# EAGLE design PA_PF_220_24_V301 (EAGLE 5.04)
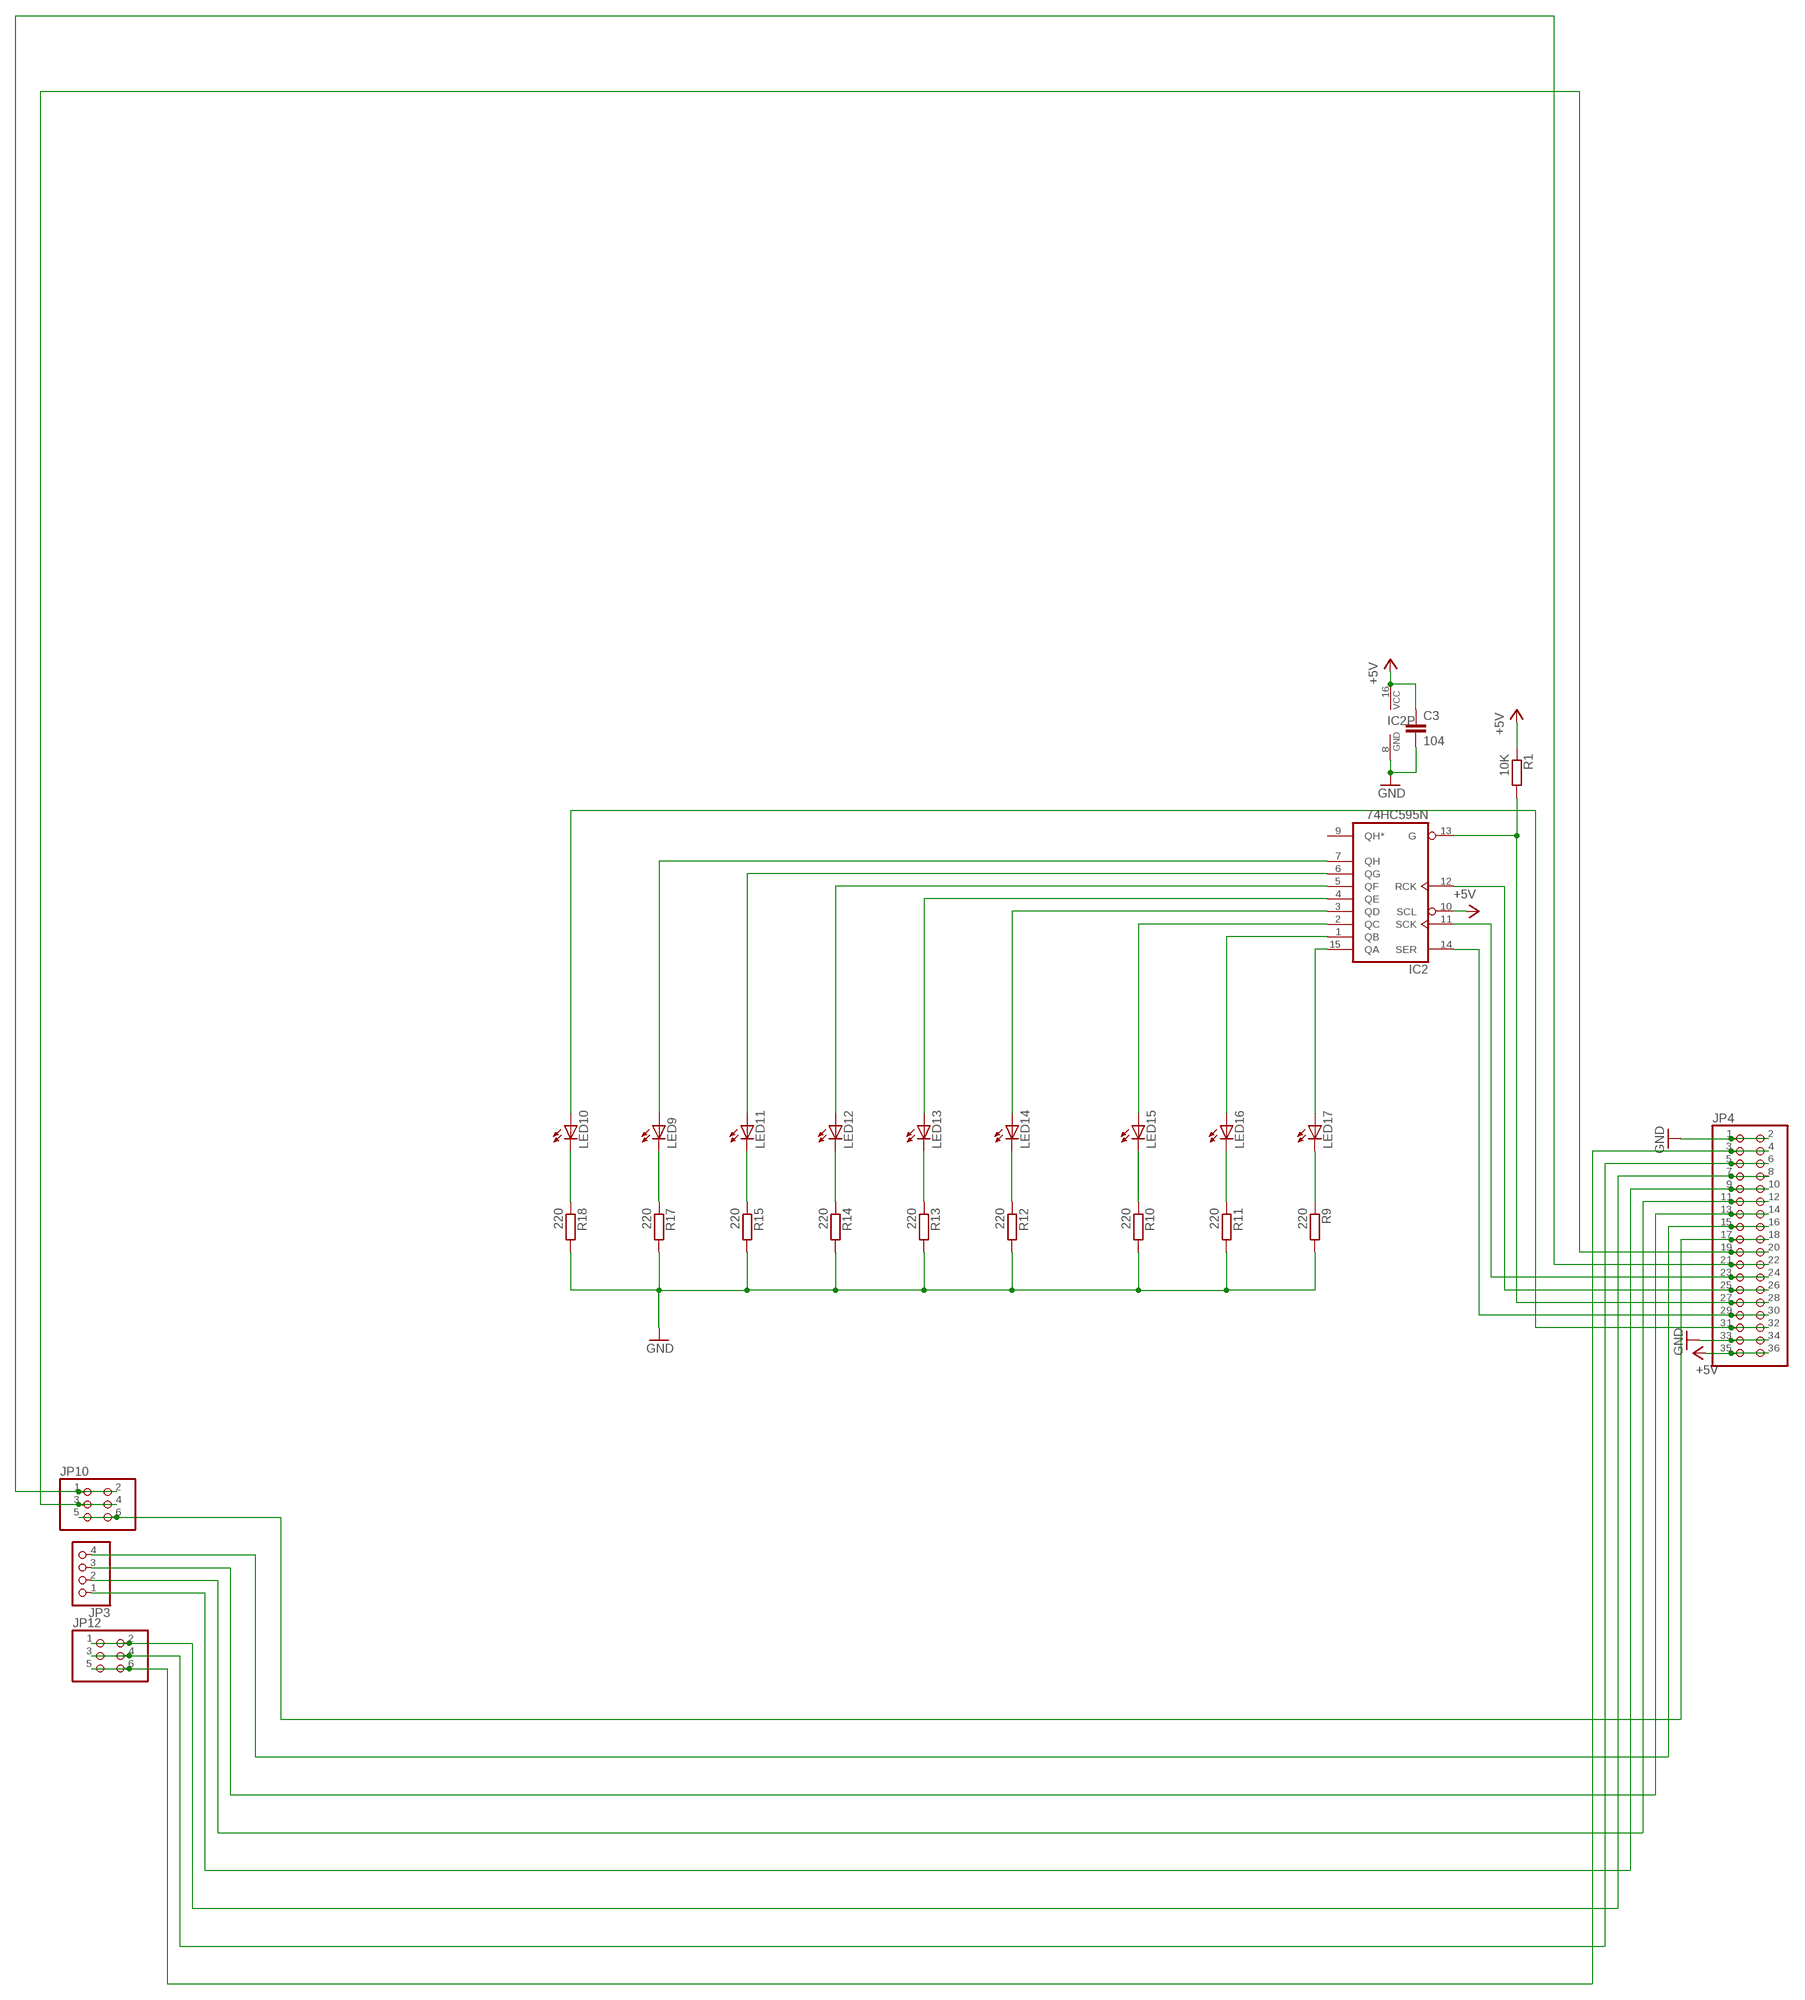
[diagram p0: schematic, sheet 1, part 1 of 3]
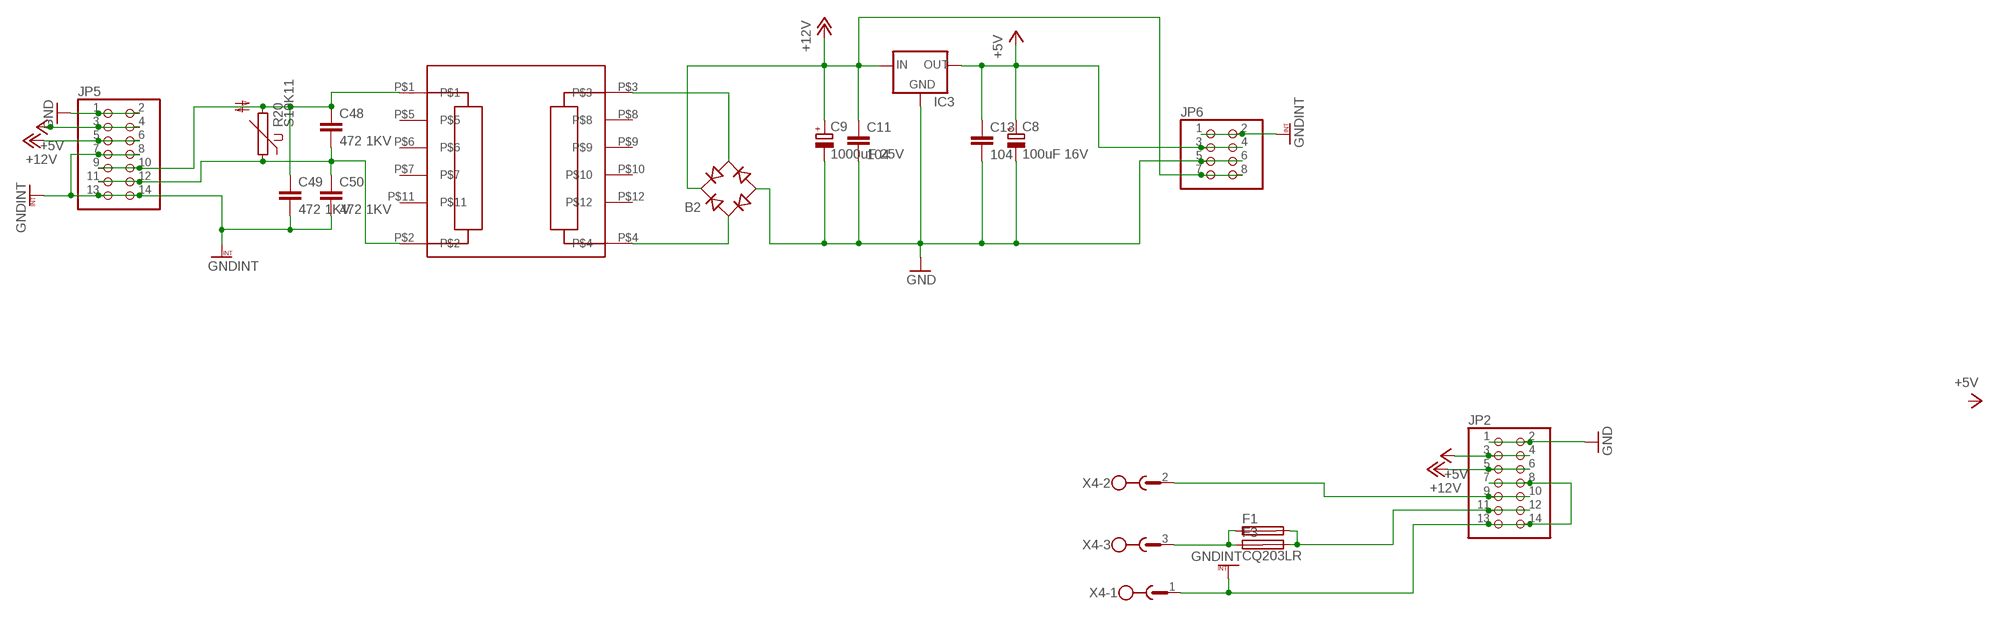
[diagram p1: schematic, sheet 1, part 2 of 3]
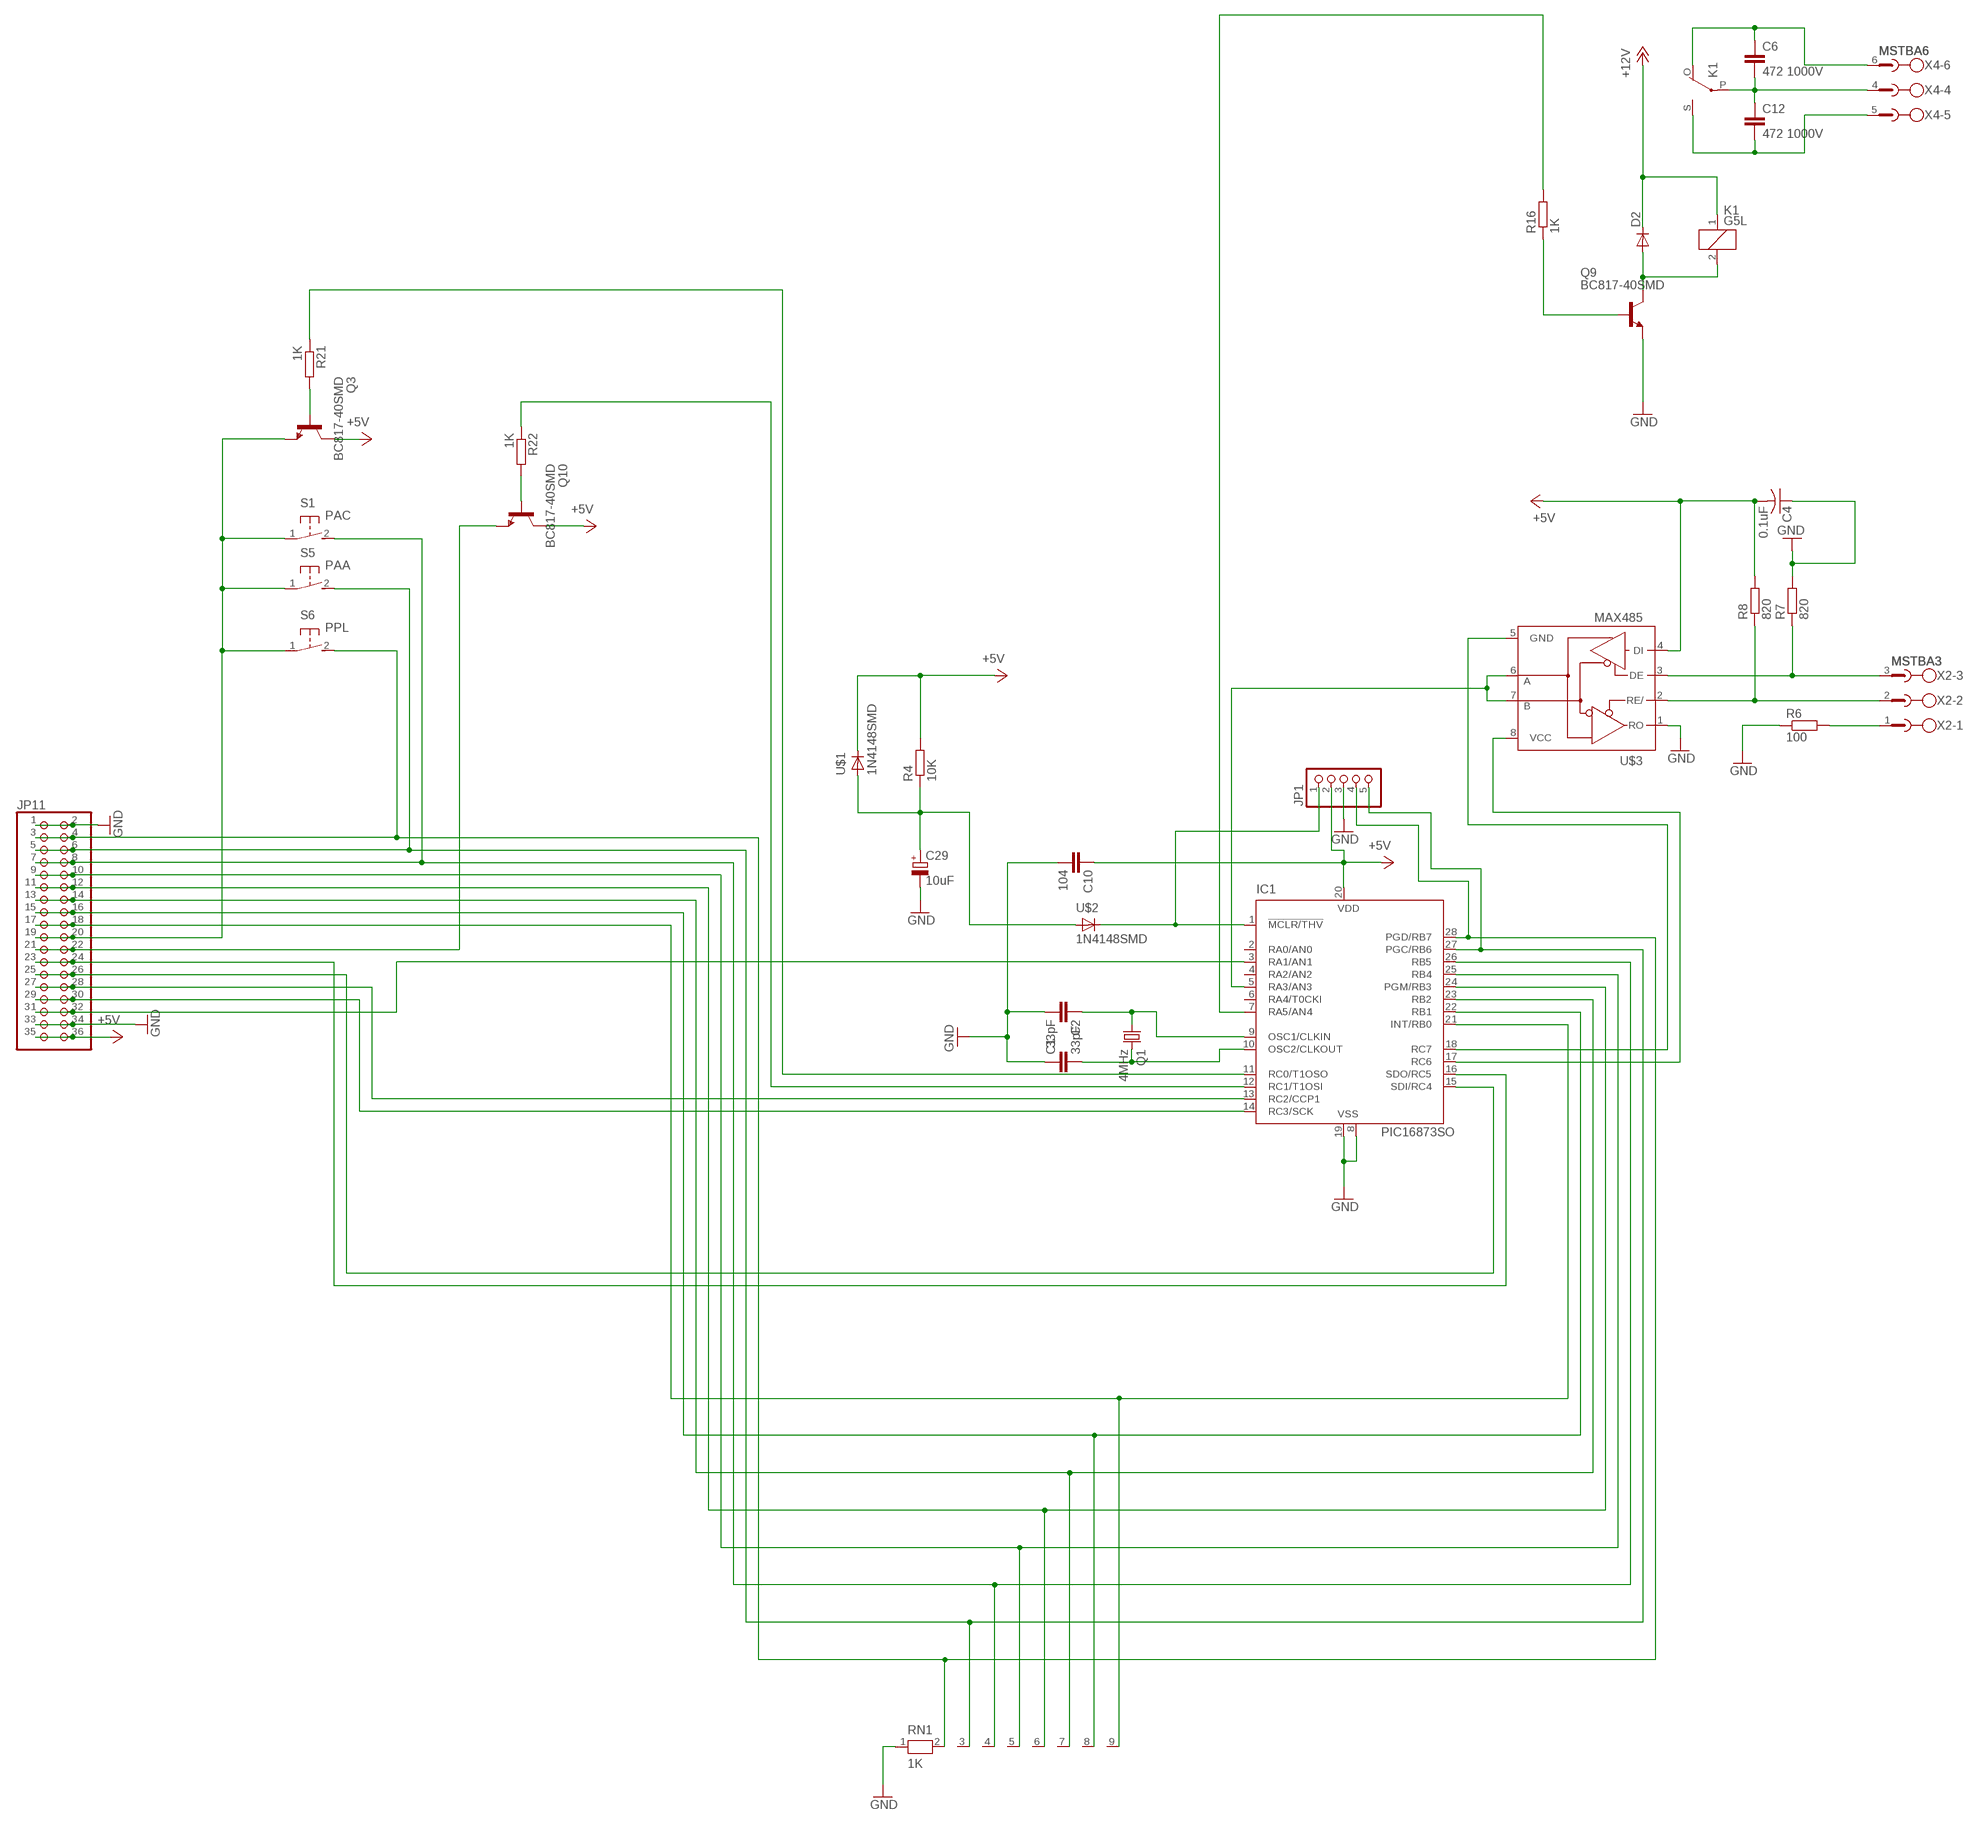
[diagram p2: schematic, sheet 1, part 3 of 3]

## Parts
B2  RB1A  [RB1A]
C1  33pF  C-EUC0805  [C0805]
C2  33pF  C-EUC0805  [C0805]
C3  104  C-EUC0805  [C0805]
C4  0.1uF  C-USC0805  [C0805]
C6  472 1000V  C-EU050-025X075  [C050-025X075]
C8  100uF 16V  CPOL-EUE2.5-6  [E2,5-6]
C9  1000uF 25V  CPOL-EUE5-10.5  [E5-10,5]
C10  104  C-EUC0805  [C0805]
C11  104  C-EUC0805  [C0805]
C12  472 1000V  C-EU050-025X075  [C050-025X075]
C13  104  C-EUC0805  [C0805]
C29  10uF  CPOL-EUE2.5-6  [E2,5-6]
C48  472 1KV  C-EU050-025X075  [C050-025X075]
C49  472 1KV  C-EU050-025X075  [C050-025X075]
C50  472 1KV  C-EU050-025X075  [C050-025X075]
D2  DIODE-DO-214AC  [DO-214AC]
F1  SH22  [SH22]
F3  CQ203LR  SHK20Q  [SHK20Q]
IC1  PIC16873SO  [SO28W]
IC2  74HC595N  [DIL16]
IC3  78XXS  [78XXS]
JP1  PINHD-1X5  [1X05]
JP2  PINHD-2X7  [2X07]
JP3  PINHD-1X4  [1X04]
JP4  PINHD-2X18  [2X18]
JP5  PINHD-2X7  [2X07]
JP6  PINHD-2X4  [2X04]
JP10  PINHD-2X3  [2X03]
JP11  PINHD-2X18  [2X18]
JP12  PINHD-2X3  [2X03]
K1  G5L  [G5LE]
LED9  LED10MM  [LED10MM]
LED10  LED5MM  [LED5MM]
LED11  LED10MM  [LED10MM]
LED12  LED10MM  [LED10MM]
LED13  LED10MM  [LED10MM]
LED14  LED10MM  [LED10MM]
LED15  LED10MM  [LED10MM]
LED16  LED10MM  [LED10MM]
LED17  LED10MM  [LED10MM]
Q1  4MHz  CRYTALHC49S  [HC49/S]
Q3  BC817-40SMD  [SOT23-BEC]
Q9  BC817-40SMD  [SOT23-BEC]
Q10  BC817-40SMD  [SOT23-BEC]
R1  10K  R-EU_M0805  [M0805]
R4  10K  R-EU_M0805  [M0805]
R6  100  R-EU_M0805  [M0805]
R7  820  R-EU_M0805  [M0805]
R8  820  R-EU_M0805  [M0805]
R9  220  R-EU_M0805  [M0805]
R10  220  R-EU_M0805  [M0805]
R11  220  R-EU_M0805  [M0805]
R12  220  R-EU_M0805  [M0805]
R13  220  R-EU_M0805  [M0805]
R14  220  R-EU_M0805  [M0805]
R15  220  R-EU_M0805  [M0805]
R16  1K  R-EU_M0805  [M0805]
R17  220  R-EU_M0805  [M0805]
R18  220  R-EU_M0805  [M0805]
R20  S10K11  [S10K11]
R21  1K  R-EU_M0805  [M0805]
R22  1K  R-EU_M0805  [M0805]
RN1  1K  RN08  [RN-9]
S1  PAC  31-XX  [B3F-31XX]
S5  PAA  31-XX  [B3F-31XX]
S6  PPL  31-XX  [B3F-31XX]
U$1  1N4148SMD  [SOD123]
U$2  1N4148SMD  [SOD123]
U$3  MAX485  [DIL08]
U$4  EI25_12/0  [EI25_12/0-PLACA]
X2  MSTBA3  [MSTBA3]
X4  MSTBA6  [MSTBA6]

## Nets
+5V: C3.1 C4.2 C8.+ C10.1 C13.1 IC1.20(VDD) IC2.10(SCL) IC2.16(VCC) IC3.OUT JP1.2 JP2.3 JP2.4 JP4.35 JP4.36 JP5.3 JP5.4 JP6.3 JP6.4 JP11.35 JP11.36 Q3.C Q10.C R1.1 R4.2 R8.2 U$1.C U$3.4(DI)
+12V: B2.+ C9.+ C11.1 D2.C IC3.IN JP2.5 JP2.6 JP5.5 JP5.6 JP6.7 JP6.8 K1.1
GND: B2.- C1.1 C2.2 C3.2 C4.1 C8.- C9.- C10.2 C11.2 C13.2 C29.- IC1.8(VSS) IC1.19(VSS) IC2.8(GND) IC3.GND JP1.3 JP2.1 JP2.2 JP4.1 JP4.2 JP4.33 JP4.34 JP5.1 JP5.2 JP6.5 JP6.6 JP11.1 JP11.2 JP11.33 JP11.34 Q9.E R6.1 R7.2 R9.2 R10.2 R11.2 R12.2 R13.2 R14.2 R15.2 R17.2 R18.2 RN1.1 U$3.1(RO)
GNDINT: C49.2 C50.2 JP2.7 JP2.8 JP2.13 JP2.14 JP5.7 JP5.8 JP5.13 JP5.14 JP6.1 JP6.2 X4.1
N$1: IC1.15(SDI/RC4) JP11.25 JP11.26
N$2: IC1.13(RC2/CCP1) JP11.27 JP11.28
N$3: IC1.24(PGM/RB3) JP11.11 JP11.12 RN1.6
N$4: IC1.14(RC3/SCK) JP11.29 JP11.30
N$6: JP4.5 JP4.6 JP12.3 JP12.4
N$7: C48.2 C50.1 JP5.11 JP5.12 R20.1 U$4.P$2
N$8: IC1.12(RC1/T1OSI) R22.1
N$9: IC1.11(RC0/T1OSO) R21.1
N$10: F1.2 F3.2A JP2.11 JP2.12
N$13: JP2.9 JP2.10 X4.2
N$14: C48.1 C49.1 JP5.9 JP5.10 R20.2 U$4.P$1
N$15: B2.AC2 U$4.P$3
N$16: JP4.3 JP4.4 JP12.5 JP12.6
N$22: IC2.7(QH) LED9.A
N$23: IC2.6(QG) LED11.A
N$24: IC2.3(QD) LED14.A
N$28: Q3.B R21.2
N$31: B2.AC1 U$4.P$4
N$32: IC1.18(RC7) U$3.5(GND)
N$33: F1.1 F3.1A X4.3
N$34: IC1.17(RC6) U$3.8(VCC)
N$35: IC1.5(RA3/AN3) U$3.6(A) U$3.7(B)
N$36: Q10.B R22.2
N$38: JP4.7 JP4.8 JP12.1 JP12.2
N$44: IC2.15(QA) LED17.A
N$45: IC2.5(QF) LED12.A
N$46: IC2.4(QE) LED13.A
N$47: IC2.2(QC) LED15.A
N$48: JP3.1 JP4.9 JP4.10
N$49: IC1.3(RA1/AN1) JP11.31 JP11.32
N$50: JP3.2 JP4.11 JP4.12
N$51: JP4.21 JP4.22 JP10.1 JP10.2
N$52: IC2.1(QB) LED16.A
N$53: R7.1 U$3.3(DE) X2.3
N$54: R8.1 U$3.2(RE/) X2.2
N$55: C6.2 C12.1 K1.P(2:P) X4.4
N$59: IC1.28(PGD/RB7) JP1.4 JP11.3 JP11.4 RN1.2 S6.2(S)
N$60: IC1.27(PGC/RB6) JP1.5 JP11.5 JP11.6 RN1.3 S5.2(S)
N$61: IC1.26(RB5) JP11.7 JP11.8 RN1.4 S1.2(S)
N$62: JP3.3 JP4.13 JP4.14
N$64: JP3.4 JP4.15 JP4.16
N$65: IC2.11(SCK) JP4.23 JP4.24
N$66: JP4.17 JP4.18 JP10.5 JP10.6
N$67: JP4.19 JP4.20 JP10.3 JP10.4
N$68: JP11.21 JP11.22 Q10.E
N$75: IC1.25(RB4) JP11.9 JP11.10 RN1.5
N$77: C2.1 IC1.9(OSC1/CLKIN) Q1.1
N$78: C1.2 IC1.10(OSC2/CLKOUT) Q1.2
N$79: IC1.1(!MCLR/THV) JP1.1 U$2.C
N$80: C29.+ R4.1 U$1.A U$2.A
N$83: IC1.23(RB2) JP11.13 JP11.14 RN1.7
N$84: IC1.16(SDO/RC5) JP11.23 JP11.24
N$85: IC2.12(RCK) JP4.25 JP4.26
N$86: R6.2 X2.1
N$87: IC1.22(RB1) JP11.15 JP11.16 RN1.8
N$88: IC2.13(G) JP4.27 JP4.28 R1.2
N$89: IC1.21(INT/RB0) JP11.17 JP11.18 RN1.9
N$90: IC2.14(SER) JP4.29 JP4.30
N$91: Q9.B R16.1
N$92: IC1.7(RA5/AN4) R16.2
N$93: D2.A K1.2 Q9.C
N$94: JP11.19 JP11.20 Q3.E S1.1(P) S5.1(P) S6.1(P)
N$95: JP4.31 JP4.32 LED10.A
N$100: LED17.K(C) R9.1
N$101: LED16.K(C) R11.1
N$103: LED15.K(C) R10.1
N$104: LED14.K(C) R12.1
N$105: LED13.K(C) R13.1
N$106: LED12.K(C) R14.1
N$107: LED11.K(C) R15.1
N$108: LED9.K(C) R17.1
N$109: LED10.K(C) R18.1
N$212: C6.1 K1.O(2:O) X4.6
N$214: C12.2 K1.S(2:S) X4.5
Unconnected: F3.1B F3.2B IC1.2(RA0/AN0) IC1.4(RA2/AN2) IC1.6(RA4/T0CKI) IC2.9(QH*) U$4.P$5 U$4.P$6 U$4.P$7 U$4.P$8 U$4.P$9 U$4.P$10 U$4.P$11 U$4.P$12

## Library data of the parts
B2 = rectifier:RB1A: RECTIFIER 1 A
C1-C3 C6 C10-C13 C48-C50 = rcl:C-EU: CAPACITOR, European symbol
C4 = rcl:C-US: CAPACITOR, American symbol
C8 C9 C29 = rcl:CPOL-EU: POLARIZED CAPACITOR, European symbol
D2 = diode:DIODE-: DIODE
F1 = fuse:SH22: FUSE HOLDER CS PFP30, Schukat
F3 = fuse:SHK20Q: FUSE HOLDER 5 x 20 mm, SH contact, E1207 Buerklin 64G6061
IC1 = microchip:PIC16*873: MICROCONTROLLER flash type
IC2 = 74xx-eu:74*595: 8-bit SHIFT REGISTER, output latch
IC3 = v-reg:78XXS: VOLTAGE REGULATOR
JP1 = pinhead:PINHD-1X5: PIN HEADER
JP2 JP5 = pinhead:PINHD-2X7: PIN HEADER
JP3 = pinhead:PINHD-1X4: PIN HEADER
JP4 JP11 = pinhead:PINHD-2X18: PIN HEADER
JP6 = pinhead:PINHD-2X4: PIN HEADER
JP10 JP12 = pinhead:PINHD-2X3: PIN HEADER
K1 = relay:G5L: RELAY 1 x switch, 10 A/120 V AC, 8 A/30 V ADC, Omron
LED9-LED17 = led:LED: LED OSRAM: - CHIPLED LG R971, LG N971, LY N971, LG Q971, LY Q971, LO R971, LY R971 LH N974, LH R974 LS Q976, LO Q976, LY Q976 LO Q996 - Hyper CHIPLED LW Q18S LB Q993, LB Q99A, LB R99A - SideLED LS A670, LO A670, LY A670, LG A670, LP A670 LB A673, LV A673, LT A673, LW A673 LH A674 LY A675 LS A676, LA A676, LO A676, LY A676, LW A676 LS A679, LY A679, LG A679 - Hyper Micro SIDELED® LS Y876, LA Y876, LO Y876, LY Y876 LT Y87S - SmartLED LW L88C, LW L88S LB L89C, LB L89S, LG L890 LS L89K, LO L89K, LY L89K LS L896, LA L896, LO L896, LY L896 - TOPLED LS T670, LO T670, LY T670, LG T670, LP T670 LSG T670, LSP T670, LSY T670, LOP T670, LYG T670 LG T671, LOG T671, LSG T671 LB T673, LV T673, LT T673, LW T673 LH T674 LS T676, LA T676, LO T676, LY T676, LB T676, LH T676, LSB T676, LW T676 LB T67C, LV T67C, LT T67C, LS T67K, LO T67K, LY T67K, LW E67C LS E67B, LA E67B, LO E67B, LY E67B, LB E67C, LV E67C, LT E67C LW T67C LS T679, LY T679, LG T679 LS T770, LO T770, LY T770, LG T770, LP T770 LB T773, LV T773, LT T773, LW T773 LH T774 LS E675, LA E675, LY E675, LS T675 LS T776, LA T776, LO T776, LY T776, LB T776 LHGB T686 LT T68C, LB T68C - Hyper Mini TOPLED® LB M676 - Mini TOPLED Santana® LG M470 LS M47K, LO M47K, LY M47K Source: http://www.osram.convergy.de LUXEON: - LUMILED® LXK2-PW12-R00, LXK2-PW12-S00, LXK2-PW14-U00, LXK2-PW14-V00 LXK2-PM12-R00, LXK2-PM12-S00, LXK2-PM14-U00 LXK2-PE12-Q00, LXK2-PE12-R00, LXK2-PE12-S00, LXK2-PE14-T00, LXK2-PE14-U00 LXK2-PB12-K00, LXK2-PB12-L00, LXK2-PB12-M00, LXK2-PB14-N00, LXK2-PB14-P00, LXK2-PB14-Q00 LXK2-PR12-L00, LXK2-PR12-M00, LXK2-PR14-Q00, LXK2-PR14-R00 LXK2-PD12-Q00, LXK2-PD12-R00, LXK2-PD12-S00 LXK2-PH12-R00, LXK2-PH12-S00 LXK2-PL12-P00, LXK2-PL12-Q00, LXK2-PL12-R00 Source: www.luxeon.com KINGBRIGHT: KA-3528ASYC Source: www.kingbright.com
Q1 = crystal:CRYTAL: CRYSTAL
Q3 Q9 Q10 = transistor-npn:BC817*: NPN Transistor
R1 R4 R6-R18 R21 R22 = rcl:R-EU_: RESISTOR, European symbol
R20 = varistor:S10K11: VARISTOR
RN1 = resistor-net:RN08: RESISTOR NETWORK
S1 S5 S6 = switch-omron:31-XX: OMRON SWITCH
U$1 U$2 = diode:1N4148SMD
U$3 = maxim:MAX485
U$4 = trafo:EI25_12/0
X2 = con-phoenix-508:MSTBA3: PHOENIX
X4 = con-phoenix-508:MSTBA6: PHOENIX

## Board
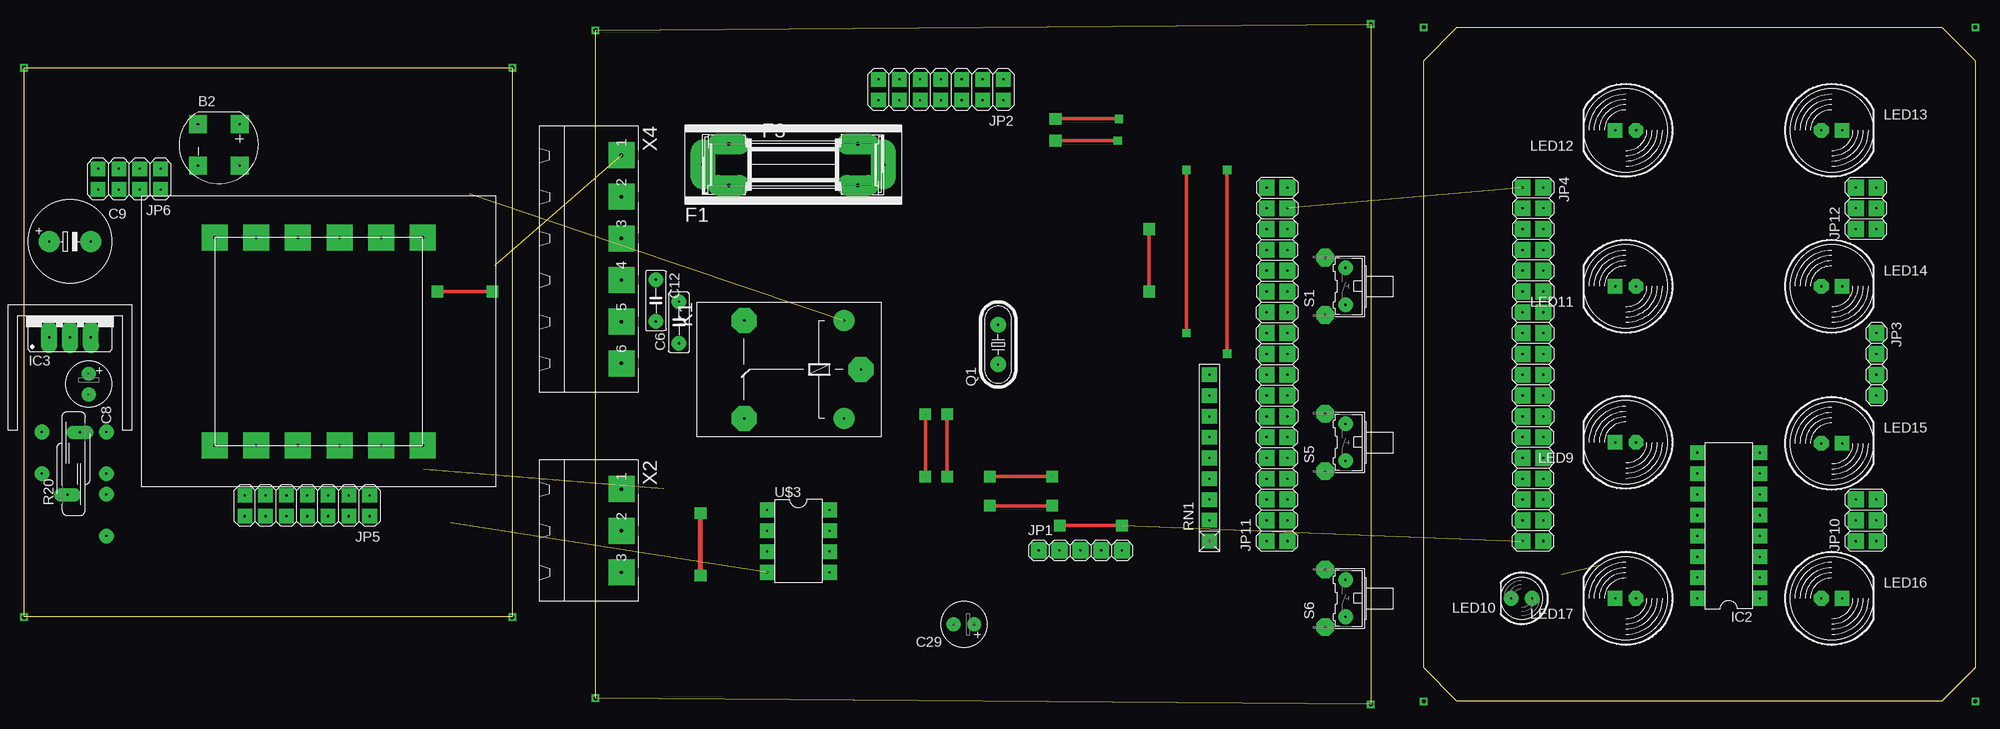
[diagram p3: board, top side]
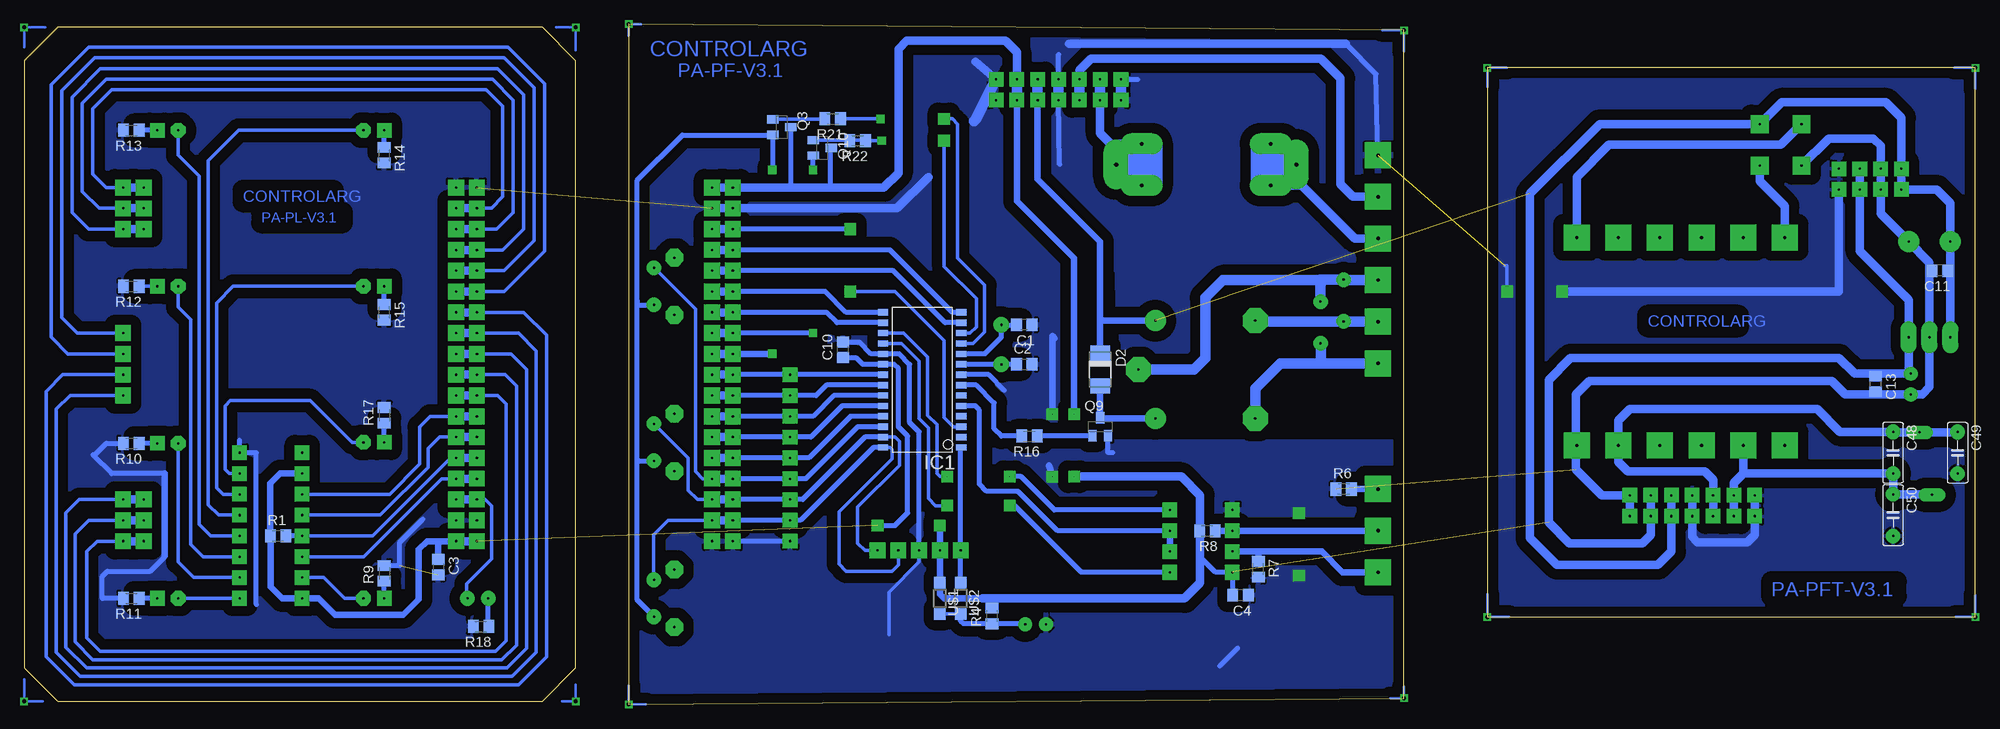
[diagram p4: board, bottom side, seen from below]

Size 238.12 x 83.06 mm. Coordinates in mm from the lower left corner, seen from the top.
Outline: 170.81,78.61 174.88,82.68 234.06,82.68 238.12,78.61 238.12,4.45 234.06,0.38 174.88,0.38 170.81,4.45 170.81,78.61
Outline: 69.72,82.3 164.34,83.06 164.34,0 69.72,0.76 69.72,82.3
Outline: 0,10.67 0,77.72 59.56,77.72 59.56,10.67 0,10.67
Copper layers (1*16): Top 0.035mm / dielectric 1.5mm / Bottom 0.035mm
Design rules "default": minimum track width 10mil, minimum drill 24mil, track to track 8mil, track to pad 8mil, pad to pad 8mil, via to via 8mil, smd to smd 8mil, copper to edge 40mil, drill to drill 8mil, minimum pad ring 10mil, minimum via ring 8mil, stop-mask expansion 4mil, vias tented up to drill 0mil, thermal gap 10mil

### Footprints (pad centres in the part's own frame; a part is rotated, then mirrored left to right if it is on the bottom)
RB1A = drill 0.254 pad 2.184 square: + -2.54,2.54; - 2.54,-2.54; AC1 2.54,2.54; AC2 -2.54,-2.54
C0805 = smd 1.3 x 1.5: 1 -0.95,0; 2 0.95,0
C050-025X075 = drill 0.254 pad 1.778 round: 1 -2.54,0; 2 2.54,0
E2,5-6 = drill 0.254 pad 1.676 round: + -1.27,0; - 1.27,0
E5-10,5 = drill 0.254 pad 2.54 round: + -2.54,0; - 2.54,0
DO-214AC = smd 1.8 x 2.4: A 2.025,0; C -2.025,0
SH22 = drill 0.5 pad 3.048 long: 1 -10.998,0; 2 10.998,0
SHK20Q = drill 0.406 pad 2.54 long: 1A -7.874,2.54; 1B -7.874,-2.54; 2A 7.874,2.54; 2B 7.874,-2.54
SO28W = smd 0.762 x 1.27: 1 -7.62,-4.78; 2 -6.35,-4.78; 3 -5.08,-4.78; 4 -3.81,-4.78; 5 -2.54,-4.78; 6 -1.27,-4.78; 7 0,-4.78; 8 1.27,-4.78; 9 2.54,-4.78; 10 3.81,-4.78; 11 5.08,-4.78; 12 6.35,-4.78; 13 7.62,-4.78; 14 8.89,-4.78; 15 8.89,4.78; 16 7.62,4.78; 17 6.35,4.78; 18 5.08,4.78; 19 3.81,4.78; 20 2.54,4.78; 21 1.27,4.78; 22 0,4.78; 23 -1.27,4.78; 24 -2.54,4.78; 25 -3.81,4.78; 26 -5.08,4.78; 27 -6.35,4.78; 28 -7.62,4.78
DIL16 = drill 0.254 pad 1.778 square: 1 -8.89,-3.81; 2 -6.35,-3.81; 3 -3.81,-3.81; 4 -1.27,-3.81; 5 1.27,-3.81; 6 3.81,-3.81; 7 6.35,-3.81; 8 8.89,-3.81; 9 8.89,3.81; 10 6.35,3.81; 11 3.81,3.81; 12 1.27,3.81; 13 -1.27,3.81; 14 -3.81,3.81; 15 -6.35,3.81; 16 -8.89,3.81
78XXS = drill 0.254 pad 1.93 long: GND 0,-2.54; IN -2.54,-2.54; OUT 2.54,-2.54
1X05 = drill 0.254 pad 1.93 square: 1 -5.08,0; 2 -2.54,0; 3 0,0; 4 2.54,0; 5 5.08,0
2X07 = drill 0.254 pad 1.778 square: 1 -7.62,-1.27; 2 -7.62,1.27; 3 -5.08,-1.27; 4 -5.08,1.27; 5 -2.54,-1.27; 6 -2.54,1.27; 7 0,-1.27; 8 0,1.27; 9 2.54,-1.27; 10 2.54,1.27; 11 5.08,-1.27; 12 5.08,1.27; 13 7.62,-1.27; 14 7.62,1.27
1X04 = drill 0.254 pad 1.93 square: 1 -3.81,0; 2 -1.27,0; 3 1.27,0; 4 3.81,0
2X18 = drill 0.254 pad 1.93 square: 1 -21.59,-1.27; 2 -21.59,1.27; 3 -19.05,-1.27; 4 -19.05,1.27; 5 -16.51,-1.27; 6 -16.51,1.27; 7 -13.97,-1.27; 8 -13.97,1.27; 9 -11.43,-1.27; 10 -11.43,1.27; 11 -8.89,-1.27; 12 -8.89,1.27; 13 -6.35,-1.27; 14 -6.35,1.27; 15 -3.81,-1.27; 16 -3.81,1.27; 17 -1.27,-1.27; 18 -1.27,1.27; 19 1.27,-1.27; 20 1.27,1.27; 21 3.81,-1.27; 22 3.81,1.27; 23 6.35,-1.27; 24 6.35,1.27; 25 8.89,-1.27; 26 8.89,1.27; 27 11.43,-1.27; 28 11.43,1.27; 29 13.97,-1.27; 30 13.97,1.27; 31 16.51,-1.27; 32 16.51,1.27; 33 19.05,-1.27; 34 19.05,1.27; 35 21.59,-1.27; 36 21.59,1.27
2X04 = drill 0.254 pad 1.778 square: 1 -3.81,-1.27; 2 -3.81,1.27; 3 -1.27,-1.27; 4 -1.27,1.27; 5 1.27,-1.27; 6 1.27,1.27; 7 3.81,-1.27; 8 3.81,1.27
2X03 = drill 0.254 pad 1.93 square: 1 -2.54,-1.27; 2 -2.54,1.27; 3 0,-1.27; 4 0,1.27; 5 2.54,-1.27; 6 2.54,1.27
G5LE = drill 0.254 pad 2.54 round: 1 -7.493,-5.969; 2 -7.493,5.969 | drill 0.254 pad 3.048 octagon: O 4.699,5.969; P -9.525,0; S 4.699,-5.969
LED10MM = drill 0.254 pad 1.778 octagon: A -1.27,0 | drill 0.254 pad 1.778 square: K 1.27,0
LED5MM = drill 0.254 pad 1.778 round: A -1.27,0; K 1.27,0
HC49/S@1 = drill 0.254 pad 1.93 round: 1 -2.413,0; 2 2.413,0
SOT23-BEC = smd 1 x 1.4: B -0.95,-1.1; C 0,1.1; E 0.95,-1.1
M0805 = smd 1.3 x 1.6: 1 -0.95,0; 2 0.95,0
S10K11 = drill 0.305 pad 1.676 long: 1 -0.762,-3.81; 2 0.762,3.81
RN-9 = drill 0.254 pad 1.778 square: 1 -10.16,0; 2 -7.62,0; 3 -5.08,0; 4 -2.54,0; 5 0,0; 6 2.54,0; 7 5.08,0; 8 7.62,0; 9 10.16,0
B3F-31XX = drill 0.254 pad 1.778 round: 1 -2.261,-1.245; 2 2.261,-1.245 | drill 0.305 pad 2.159 octagon: 3 -3.505,1.245; 4 3.505,1.245
SOD123 = smd 1.4 x 1.4: A 1.9,0; C -1.9,0
DIL08 = drill 0.254 pad 1.778 square: 1 -3.81,-3.81; 2 -1.27,-3.81; 3 1.27,-3.81; 4 3.81,-3.81; 5 3.81,3.81; 6 1.27,3.81; 7 -1.27,3.81; 8 -3.81,3.81
EI25_12/0-PLACA = drill 0.381 pad 3.175 square: P$1 -12.7,-7.62; P$2 -12.7,7.62; P$3 12.7,-12.7; P$4 12.7,12.7; P$5 -12.7,12.7; P$6 -12.7,-12.7; P$7 -12.7,-2.54; P$8 -12.7,2.54; P$9 12.7,-7.62; P$10 12.7,-2.54; P$11 12.7,2.54; P$12 12.7,7.62
MSTBA3 = drill 0.406 pad 3.175 square: 1 -5.08,5.08; 2 0,5.08; 3 5.08,5.08
MSTBA6 = drill 0.406 pad 3.175 square: 1 -12.7,5.08; 2 -7.62,5.08; 3 -2.54,5.08; 4 2.54,5.08; 5 7.62,5.08; 6 12.7,5.08

### Placement (x,y rotation side)
B2  23.75,68.33 270 top
C1  116.08,46.36 180 bottom
C2  116.08,41.53 0 bottom
C3  187.58,16.76 270 bottom
C4  89.66,13.34 180 bottom
C6  79.91,46.64 90 top
C8  7.87,39.12 270 top
C9  5.59,56.52 0 top
C10  138.18,43.31 90 bottom
C11  4.32,52.96 180 bottom
C12  77.09,49.31 270 top
C13  12.19,39.12 270 bottom
C29  114.68,9.78 180 top
C48  10.03,30.73 270 bottom
C49  2.16,30.73 270 bottom
C50  10.03,23.11 270 bottom
D2  106.81,40.89 270 bottom
F1  93.85,65.91 0 top
F3  93.85,65.91 0 top
IC1  128.52,38.99 90 bottom
IC2  208.03,21.84 90 top
IC3  5.59,47.37 0 top
JP1  128.91,18.8 0 top
JP2  111.89,75.06 180 top
JP3  226.06,41.53 270 top
JP4  184.15,41.53 270 top
JP5  34.54,24.26 180 top
JP6  12.83,64.14 180 top
JP10  224.79,22.48 90 top
JP11  152.91,41.53 90 top
JP12  224.79,60.58 90 top
K1  92.58,40.89 180 top
LED9  195.45,32 180 top
LED10  182.75,12.95 180 top
LED11  195.45,51.05 180 top
LED12  195.45,70.1 180 top
LED13  220.6,70.1 0 top
LED14  220.6,51.05 0 top
LED15  220.6,31.88 0 top
LED16  220.6,12.95 0 top
LED17  195.45,12.95 180 top
Q1  4MHz  [HC49/S@1]  118.87,43.94 90 top
Q3  145.67,70.48 270 bottom
Q9  106.81,33.91 0 bottom
Q10  140.72,67.95 270 bottom
R1  207.14,20.57 0 bottom
R4  120.02,10.8 90 bottom
R6  77.09,26.29 0 bottom
R7  87.5,16.51 270 bottom
R8  93.73,21.21 180 bottom
R9  194.18,16 90 bottom
R10  225.04,31.88 180 bottom
R11  225.04,12.95 180 bottom
R12  225.04,51.05 180 bottom
R13  225.04,70.1 180 bottom
R14  194.18,67.06 270 bottom
R15  194.18,47.88 270 bottom
R16  115.44,32.77 180 bottom
R17  194.18,35.31 90 bottom
R18  182.37,9.53 180 bottom
R20  6.03,29.42 0 top
R21  139.45,71.5 180 bottom
R22  136.4,68.83 180 bottom
RN1  144.65,30.1 90 top
S1  160.02,51.05 90 top
S5  160.02,32 90 top
S6  160.02,12.95 90 top
U$1  126.37,12.95 270 bottom
U$2  123.83,12.95 270 bottom
U$3  94.49,19.94 270 top
U$4  35.94,44.32 90 top
U$6  [U15X15]  5.59,48.77 180 top
X2  67.82,21.21 270 top
X4  67.82,54.36 270 top

### Tracks (layer width: path | path; a pad name or v marks a point on that pad's centre or on a via)
+5V  (via drill 0.01 pad 1.42)  (3 unrouted)
  Top 0.406: v126.37,21.84 v133.99,21.84 | v109.98,27.81 v109.98,35.43
  Bottom 0.406: 144.53,70.44 Q3.C | Q10.C 139.57,67.9
  Bottom 0.61: Q10.C 139.7,67.86 139.7,63.12 | 144.53,70.44 144.53,63.12 145.42,63.12 | C4.2 90.61,16.19 | 94.62,18.03 92.71,16.13 U$3.4 | R4.2 120.02,12.83 120.14,12.95 | C10.1 138.11,42.29 136.53,42.29 135.76,41.53 IC1.20 131.95,41.53 131.44,41.02 131.44,33.91 130.3,32.77 130.3,23.37 131.83,21.84 v133.99,21.84
  Bottom 0.813: JP4.36 187.83,19.94 | 187.83,19.94 188.98,19.94 189.99,18.92 189.99,12.83 191.9,10.92 200.15,10.92 202.18,12.95 IC2.16 206.63,12.95 208.03,14.35 208.03,20.51 R1.1 208.09,26.99 206.88,28.19 IC2.10 | 121.16,12.95 125.86,12.95 126.37,13.46 U$1.C JP1.2 v126.37,21.84 | C3.1 187.58,19.69 187.83,19.94 | v109.98,35.43 109.98,54.48 116.97,61.47 JP2.4
  Bottom 1.016: JP4.35 JP4.36 | JP2.3 116.97,79.63 118.36,81.03 130.43,81.03 131.44,80.01 131.44,64.9 133.22,63.12 139.7,63.12 145.42,63.12 JP11.36 JP11.35 | 94.62,21.59 94.62,18.03 94.62,14.86 96.52,12.95 120.14,12.95 121.16,12.95 | R8.2 94.68,21.53 94.62,21.59 | JP6.3 JP6.4 14.1,55.37 8.13,49.4 IC3.OUT 8.13,40.64 C8.+ 12.32,40.39 | JP5.3 JP5.4 39.62,20.7 40.64,19.69 49.53,19.69 52.07,22.23 52.07,39.62 49.4,42.29 16.64,42.29 14.73,40.39 12.32,40.39 | 94.62,21.59 94.62,25.53 96.9,27.81 v109.98,27.81 | C13.1 12.19,40.26 12.32,40.39
  Bottom 1.27: JP2.4 JP2.3
+12V  (1 unrouted)
  Bottom 0.813: JP2.6 114.43,64.14 106.81,56.52 106.81,46.86 | 106.81,46.86 D2.C | K1.1 106.81,46.86
  Bottom 1.016: JP5.5 JP5.6 37.08,18.67 38.74,17.02 51.05,17.02 54.36,20.32 54.36,62.36 45.85,70.87 B2.+ 23.62,73.53 10.92,73.53 9.02,71.63 JP6.7 JP6.8 4.7,62.87 3.05,61.21 C9.+ 3.05,52.96 | 3.05,52.96 IC3.IN | 3.05,52.96 C11.1
  Bottom 1.27: JP2.6 JP2.5
GND  (via drill 0.01 pad 1.42)  (3 unrouted)
  Top 0.406: v112.65,27.81 v112.65,35.43
  Top 0.61: v82.55,15.75 v82.55,23.37
  Bottom 0.406: JP1.3 128.91,17.4 132.59,13.72 132.59,8.51
  Bottom 0.61: RN1.1 JP11.2 | 209.8,12.19 209.8,30.73 IC2.8 211.84,32.26 | R9.2 192.28,16.95 192.28,19.81 189.48,22.61 | JP1.3 128.91,33.27 130.05,34.42 130.05,41.53 131.32,42.8 IC1.19 134.75,42.8 136.14,44.2 138.12,44.2 C10.2 | 90.04,6.86 92.2,4.7 | IC1.8 120.4,40.26 118.49,38.35 | Q9.E 105.86,30.8 105.79,30.73 105.28,30.73 | 220.98,28.19 227.46,28.19 229.74,30.48 229.49,30.48 228.09,31.88 R10.2 | 220.98,18.16 220.98,18.03 222.76,16.26 227.97,16.26 228.6,15.62 228.6,12.95 R11.2
  Bottom 0.813: 112.4,44.7 112.65,44.96 v112.65,35.43 112.65,41.78 | v112.65,27.81 113.03,29.21 | 220.98,18.16 220.98,28.19
  Bottom 1.016: JP11.33 JP11.34 131.57,60.58 127.76,64.39 | JP2.1 122.05,78.49 | B2.- 17.91,69.09 12.45,69.09 11.56,68.2 JP6.5 JP6.6 11.56,59.94 C9.- 5.59,53.98 5.59,52.96 | 12.19,37.85 C8.- 6.48,37.85 5.59,38.73 IC3.GND 5.59,52.96 | 12.19,37.85 C13.2 | 5.59,52.96 C11.2 | JP5.2 JP5.1 45.59,25.53 48.77,28.7 48.77,37.85 47.12,39.5 17.53,39.5 15.88,37.85 12.19,37.85
  Bottom 1.27: JP2.1 122.05,71.37 122.17,71.25
  pour Bottom (isolate 1.27): 170.81,82.68 170.81,0.38 238.12,0.38 238.12,82.68
  pour Bottom (isolate 1.27): 105.66,32.13 69.98,32.13 69.72,0.76 164.34,0 164.34,83.06 116.59,82.68 117.09,70.23 117.48,62.23 105.66,50.42
GNDINT  (via drill 0.01 pad 1.42)  (1 unrouted)
  Top 0.406: v50.42,50.42 v57.15,50.42
  Bottom 0.406: v57.15,50.42 57.15,53.59 57.4,53.59
  Bottom 0.61: X4.1 73.15,76.96 76.84,80.64 | JP2.7 111.89,79.38 | JP2.13 102.24,76.33 | 111.76,65.91 JP2.8
  Bottom 1.016: 76.84,80.64 110.62,80.64 | JP5.7 JP5.8 34.54,20.45 33.91,19.81 27.81,19.81 26.92,20.7 JP5.14 JP5.13 | JP6.2 16.64,50.42 v50.42,50.42
  Bottom 1.27: JP2.8 JP2.7 | JP2.14 JP2.13
  pour Bottom (isolate 1.27): 69.72,82.3 114.94,82.68 115.19,63.25 104.65,52.83 104.39,34.42 69.72,34.42
  pour Bottom (isolate 1.27): 0,77.72 0,10.67 59.56,10.67 59.56,77.72
N$1
  Bottom 0.61: IC1.15 137.8,47.88 140.34,50.42 JP11.26
  Bottom 1.016: JP11.26 JP11.25
N$2
  Bottom 0.61: IC1.13 125.73,46.61 132.08,52.96 JP11.28
  Bottom 1.016: JP11.28 JP11.27
N$3
  Bottom 0.61: IC1.24 138.3,36.45 142.11,32.64 RN1.6 JP11.12
  Bottom 1.016: JP11.12 JP11.11
N$4
  Bottom 0.61: IC1.14 124.84,47.88 132.46,55.5 JP11.30
  Bottom 1.016: JP11.30 JP11.29
N$5  (via drill 0.5)
  other vias: 170.81,0.38
N$6
  Bottom 0.406: JP4.5 180.47,58.04 178.44,60.07 178.44,73.79 180.98,76.33 228.09,76.33 231.01,73.41 231.01,62.61 228.98,60.58 JP12.3
  Bottom 1.016: JP12.3 JP12.4 | JP4.5 JP4.6
N$7
  Bottom 1.016: U$4.P$2 28.32,28.19 | 28.32,28.19 29.46,27.05 JP5.11 JP5.12 | R20.1 5.32,25.65 C50.1 C48.2 28.32,28.19
N$8  (via drill 0.01 pad 1.02, 0.01 pad 1.42)
  Top 0.406: v125.86,68.83 v133.48,68.83
  Bottom 0.406: v133.48,68.83 R22.1 | v125.86,68.83 125.86,53.47 121.92,49.53 121.92,46.1 122.68,45.34 IC1.12
N$9  (via drill 0.01 pad 1.02, 0.01 pad 1.42)
  Top 0.406: v125.86,71.5 v133.6,71.5
  Bottom 0.406: v133.6,71.5 R21.1 | IC1.11 122.3,44.07 120.9,45.47 120.9,51.18 124.21,54.48 124.21,70.87 124.84,71.5 v125.86,71.5
N$10
  Bottom 1.016: JP2.12 106.81,69.72 105.41,68.33 105.03,68.45 | 105.03,68.45 F3.2A | F1.2 105.03,66.09 105.03,68.45
  Bottom 1.27: JP2.12 JP2.11
N$13
  Bottom 1.016: JP2.9 109.35,77.47 107.95,78.87 79.88,78.87 77.47,76.45 77.47,63.5 75.95,61.98 X4.2
  Bottom 1.27: JP2.9 JP2.10
N$14
  Bottom 1.016: C49.1 2.33,33.23 R20.2 9.98,33.23 C48.1 16.51,33.27 19.3,36.07 42.16,36.07 43.56,34.67 U$4.P$1 43.56,29.59 42.42,28.45 33.02,28.45 32,27.43 JP5.9 JP5.10
N$15
  Bottom 1.016: U$4.P$3 48.64,64.39 44.7,68.33 23.75,68.33 B2.AC2
N$16
  Bottom 0.406: JP12.5 228.09,63.12 229.74,64.77 229.74,72.77 227.46,75.06 181.74,75.06 179.71,73.03 179.71,61.98 181.1,60.58 JP4.3
  Bottom 1.016: JP12.5 JP12.6 | JP4.3 JP4.4
N$18  (via drill 0.5)
  Bottom 0.305: 0,75.18 v0,77.72 2.54,77.72
N$19  (via drill 0.5)
  Bottom 0.305: 59.56,75.44 v59.56,77.72 57.15,77.72
N$20  (via drill 0.5)
  Bottom 0.305: 59.56,13.46 v59.56,10.67 56.9,10.67
N$21  (via drill 0.5)
  Bottom 0.305: 2.41,10.67 v0,10.67 0,13.34
N$22
  Bottom 0.406: IC2.7 213.11,28.19 213.61,28.7 213.61,36.45 212.98,37.08 203.2,37.08 198.12,32 LED9.A
N$23
  Bottom 0.406: IC2.6 213.87,25.65 214.63,26.42 214.63,49.02 212.6,51.05 LED11.A
N$24
  Bottom 0.406: IC2.3 216.28,18.03 217.81,19.56 217.81,46.99 219.33,48.51 LED14.A
N$26  (via drill 0.5)
  Bottom 0.305: 238.12,3.05 v238.12,0.38 235.84,0.38
N$27  (via drill 0.5)
  Bottom 0.305: 69.72,79.76 v69.72,82.3 72.39,82.3
N$28
  Bottom 0.406: Q3.B 140.46,71.44 R21.2
N$31
  Bottom 1.016: U$4.P$4 23.24,60.83 26.29,63.88 B2.AC1
N$32  (via drill 0.01 pad 1.42)
  Top 0.406: v117.86,24.26 v125.48,24.26
  Bottom 0.406: v125.48,24.26 126.87,24.26 127.76,25.15 127.76,33.78 128.91,34.92 128.91,41.91 131.06,44.07 IC1.18
  Bottom 0.61: v117.86,24.26 117.22,24.26 109.09,16.13 U$3.5
N$33
  Bottom 0.61: X4.3 73.28,56.9
  Bottom 1.016: 83.31,63.37 82.8,63.37 82.86,63.42 F1.1 82.8,65.96 82.8,67.06 84.2,68.45 F3.1A | 83.31,63.37 85.98,63.37 | 73.28,56.9 75.69,56.9 82.17,63.37 83.31,63.37
N$34  (via drill 0.01 pad 1.42)
  Top 0.406: v117.86,27.81 v125.48,27.81
  Bottom 0.406: v125.48,27.81 126.37,27.81 126.75,28.19 126.75,34.16 127.89,35.31 127.89,42.42 130.81,45.34 IC1.17
  Bottom 0.61: v117.86,27.81 116.46,27.81 112.4,23.75 U$3.8
N$35
  Bottom 0.61: IC1.5 122.05,36.45 121.54,35.94 121.54,26.92 120.65,26.04 116.84,26.04 112.01,21.21 U$3.7
  Bottom 0.813: U$3.6 U$3.7
N$36
  Bottom 0.406: Q10.B 136.01,68.89 R22.2
N$38
  Bottom 0.406: JP4.7 179.71,55.5 177.17,58.04 177.17,74.42 180.34,77.6 228.85,77.6 232.28,74.17 232.28,60.07 230.25,58.04 JP12.1
  Bottom 1.016: JP12.1 JP12.2 | JP4.7 JP4.8
N$44
  Bottom 0.406: LED17.A 199.01,12.95 201.55,15.49 IC2.15
N$45
  Bottom 0.406: IC2.5 214.38,23.11 215.65,24.38 215.65,66.42 211.96,70.1 LED12.A
N$46
  Bottom 0.406: IC2.4 215.39,20.57 216.79,21.97 216.79,64.52 219.33,67.06 LED13.A
N$47
  Bottom 0.406: IC2.2 217.42,15.49 219.33,17.4 LED15.A
N$48
  Bottom 0.406: JP4.9 179.58,52.96 175.9,56.64 175.9,75.31 179.58,78.99 229.49,78.99 233.55,74.93 233.55,47.24 231.65,45.34 JP3.1
  Bottom 1.016: JP4.9 JP4.10
N$49  (via drill 0.01 pad 1.42)
  Top 0.406: v137.29,50.42 v137.29,58.04
  Bottom 0.406: IC1.3 124.71,33.91 125.86,35.05 125.86,44.45 131.83,50.42 v137.29,50.42
  Bottom 0.61: v137.29,58.04 JP11.32
  Bottom 1.016: JP11.32 JP11.31
N$50
  Bottom 0.406: JP4.11 179.58,50.42 174.62,55.37 174.62,75.82 179.07,80.26 230.25,80.26 234.82,75.69 234.82,44.83 232.79,42.8 JP3.2
  Bottom 1.016: JP4.11 JP4.12
N$51
  Bottom 0.406: JP4.21 180.34,37.72 179.32,36.7 179.32,7.75 180.59,6.48 228.85,6.48 230.5,8.13 230.5,18.67 229.24,19.94 JP10.1
  Bottom 1.016: JP4.21 JP4.22 | JP10.1 JP10.2
N$52
  Bottom 0.406: IC2.1 LED16.A
N$53
  Bottom 0.813: X2.3 77.22,16.13 79.76,18.67 87.5,18.67 | 87.5,18.67 U$3.3 | 87.5,18.67 R7.1
N$54
  Bottom 0.813: X2.2 U$3.2 R8.1
N$55
  Bottom 1.27: X4.4 77.06,51.82 C12.1 79.38,51.85 | 79.38,51.85 79.92,51.85 79.91,51.85 C6.2 | K1.P 95.38,40.89 93.98,42.29 93.98,49.66 91.82,51.82 79.41,51.82 79.38,51.85
N$59
  Bottom 0.406: JP1.4 131.44,17.02 132.21,16.26 137.8,16.26 138.68,17.15 138.68,23.5 132.21,29.97 132.21,31.12 132.46,31.37 IC1.28 | JP11.3 159.51,22.48 161.29,20.7 161.29,15.24 S6.2
  Bottom 0.61: JP11.4 RN1.2 143.38,22.48 134.49,31.37 IC1.28
  Bottom 1.016: JP11.4 JP11.3
N$60
  Bottom 0.406: IC1.27 131.83,32.64 131.32,32.13 131.32,29.21 136.4,24.13 136.4,19.69 135.51,18.8 JP1.5 | JP11.5 155.96,25.02 157.1,26.16 157.1,30.1 S5.2
  Bottom 0.61: JP11.6 RN1.3 143.13,25.02 135.51,32.64 IC1.27
  Bottom 1.016: JP11.6 JP11.5
N$61
  Bottom 0.406: JP11.7 155.32,27.56 156.21,28.45 156.21,48.26 S1.2
  Bottom 0.61: JP11.8 RN1.4 142.75,27.56 136.4,33.91 IC1.26
  Bottom 1.016: JP11.8 JP11.7
N$62
  Bottom 0.406: JP4.13 177.17,47.88 174.37,45.09 174.37,5.84 177.8,2.41 232.03,2.41 235.46,5.84 235.46,38.23 233.43,40.26 JP3.3
  Bottom 1.016: JP4.13 JP4.14
N$64
  Bottom 0.406: JP4.15 177.8,45.34 175.64,43.18 175.64,6.35 178.56,3.43 231.27,3.43 234.19,6.35 234.19,36.07 232.54,37.72 JP3.4
  Bottom 1.016: JP4.15 JP4.16
N$65
  Bottom 0.406: IC2.11 193.55,25.65 189.87,29.34 189.87,33.91 188.6,35.18 JP4.24
  Bottom 1.016: JP4.23 JP4.24
N$66
  Bottom 0.406: JP4.17 178.69,42.8 176.78,40.89 176.78,6.86 179.2,4.45 230.5,4.45 233.05,6.98 233.05,23.37 231.39,25.02 JP10.5
  Bottom 1.016: JP4.17 JP4.18 | JP10.5 JP10.6
N$67
  Bottom 0.406: JP4.19 179.45,40.26 178.05,38.86 178.05,7.24 179.83,5.46 229.74,5.46 231.9,7.62 231.9,20.83 230.25,22.48 JP10.3
  Bottom 1.016: JP4.19 JP4.20 | JP10.3 JP10.4
N$68  (via drill 0.01 pad 1.02)
  Top 0.406: v141.86,45.34 v141.86,65.28
  Bottom 0.61: v141.86,45.34 JP11.22 | v141.86,65.28 141.86,66.95 Q10.E
  Bottom 1.016: JP11.22 JP11.21
N$75
  Bottom 0.61: JP11.10 RN1.5 142.37,30.1 137.29,35.18 IC1.25
  Bottom 1.016: JP11.10 JP11.9
N$77
  Bottom 0.61: IC1.9 Q1.1 C2.1
N$78
  Bottom 0.61: IC1.10 120.9,42.8 118.87,44.83 Q1.2 C1.2
N$79
  Bottom 0.406: 123.83,31.29 IC1.1
  Bottom 0.61: 123.83,31.29 JP1.1 U$2.C
N$80
  Bottom 0.254: U$1.A 126.75,10.92
  Bottom 0.406: U$1.A U$2.A
  Bottom 0.61: C29.+ 116.02,9.85 R4.1 123.51,9.85 123.83,10.16 U$2.A
N$83
  Bottom 0.61: IC1.23 139.32,37.72 141.86,35.18 RN1.7 JP11.14
  Bottom 1.016: JP11.14 JP11.13
N$84
  Bottom 0.61: IC1.16 138.94,46.61 140.21,47.88 JP11.24
  Bottom 1.016: JP11.24 JP11.23
N$85
  Bottom 0.406: IC2.12 194.69,23.11 188.85,28.96 188.85,31.24 187.45,32.64 JP4.26
  Bottom 1.016: JP4.25 JP4.26
N$86
  Bottom 0.813: X2.1 R6.2
N$87
  Bottom 0.61: JP11.16 RN1.8 141.48,37.72 140.21,38.99 IC1.22
  Bottom 1.016: JP11.16 JP11.15
N$88
  Bottom 0.406: IC2.13 195.58,20.57 186.06,30.1 JP4.28
  Bottom 0.61: IC2.13 R1.2
  Bottom 1.016: JP4.27 JP4.28
N$89
  Bottom 0.61: JP11.18 RN1.9 IC1.21
  Bottom 1.016: JP11.18 JP11.17
N$90
  Bottom 0.406: JP4.30 187.2,27.56 196.72,18.03 IC2.14
  Bottom 1.016: JP4.29 JP4.30
N$91
  Bottom 0.61: Q9.B 114.45,32.81 R16.1
N$92
  Bottom 0.61: IC1.7 121.92,38.99 119.76,36.83 119.76,33.66 118.87,32.77 R16.2
N$93
  Bottom 0.813: K1.2 106.72,34.92 Q9.C D2.A
N$94  (via drill 0.01 pad 1.02)
  Top 0.406: v146.81,65.28 v146.81,42.8
  Bottom 0.61: v146.81,65.28 146.81,69.49 Q3.E 157.8,69.53 163.32,64.01 163.32,49.28 | S6.1 163.32,12.75 163.32,29.97 | 163.32,29.97 163.32,49.28 | S1.1 163.32,48.79 163.32,49.28 | S5.1 163.32,29.74 163.32,29.97
  Bottom 0.813: v146.81,42.8 JP11.20
  Bottom 1.016: JP11.20 JP11.19
N$95
  Bottom 0.406: LED10.A 184.15,13.08 184.15,14.73 181.1,17.78 181.1,24.26 181.86,25.02 JP4.31
  Bottom 1.016: JP4.31 JP4.32
N$100
  Bottom 0.61: LED17.K R9.1
N$101
  Bottom 0.61: LED16.K R11.1
N$103
  Bottom 0.61: LED15.K R10.1
N$104
  Bottom 0.406: LED14.K R12.1
N$105
  Bottom 0.61: LED13.K R13.1
N$106
  Bottom 0.61: R14.1 LED12.K
N$107
  Bottom 0.61: R15.1 LED11.K
N$108
  Bottom 0.61: LED9.K R17.1
N$109
  Bottom 0.61: LED10.K 181.48,9.59 R18.1
N$124  (via drill 0.5)
  Bottom 0.305: 238.12,80.26 v238.12,82.68 235.58,82.68
N$145  (via drill 0.5)
  Bottom 0.305: 173.23,82.68 v170.81,82.68 170.81,79.88
N$146
  Bottom 0.305: 170.81,0.38 170.81,2.41
N$147  (via drill 0.5)
  Bottom 0.305: 164.34,2.29 v164.34,0 162.31,0
N$148  (via drill 0.5)
  Bottom 0.305: 164.34,81.66 v164.34,83.06 162.81,83.06
N$149
  Bottom 0.305: 170.81,0.38 172.47,0.38
N$150  (via drill 0.5)
  Bottom 0.305: 69.72,2.16 v69.72,0.76 71.37,0.76
N$212
  Bottom 1.27: X4.6 79.88,41.66 | C6.1 79.88,44.07 79.88,41.66 | 79.88,41.66 84.84,41.66 87.88,38.61 K1.O
N$214
  Bottom 1.27: X4.5 77.06,46.74 C12.2 86.27,46.77 K1.S
(copper drawn outside any net)
  shapes: Bottom area x2

### Text on the board
Bottom: CONTROLARG | PA-PF-V3.1 | CONTROLARG | PA-PL-V3.1 | CONTROLARG | PA-PFT-V3.1